# EAGLE design Muleta (EAGLE 9.3.2)
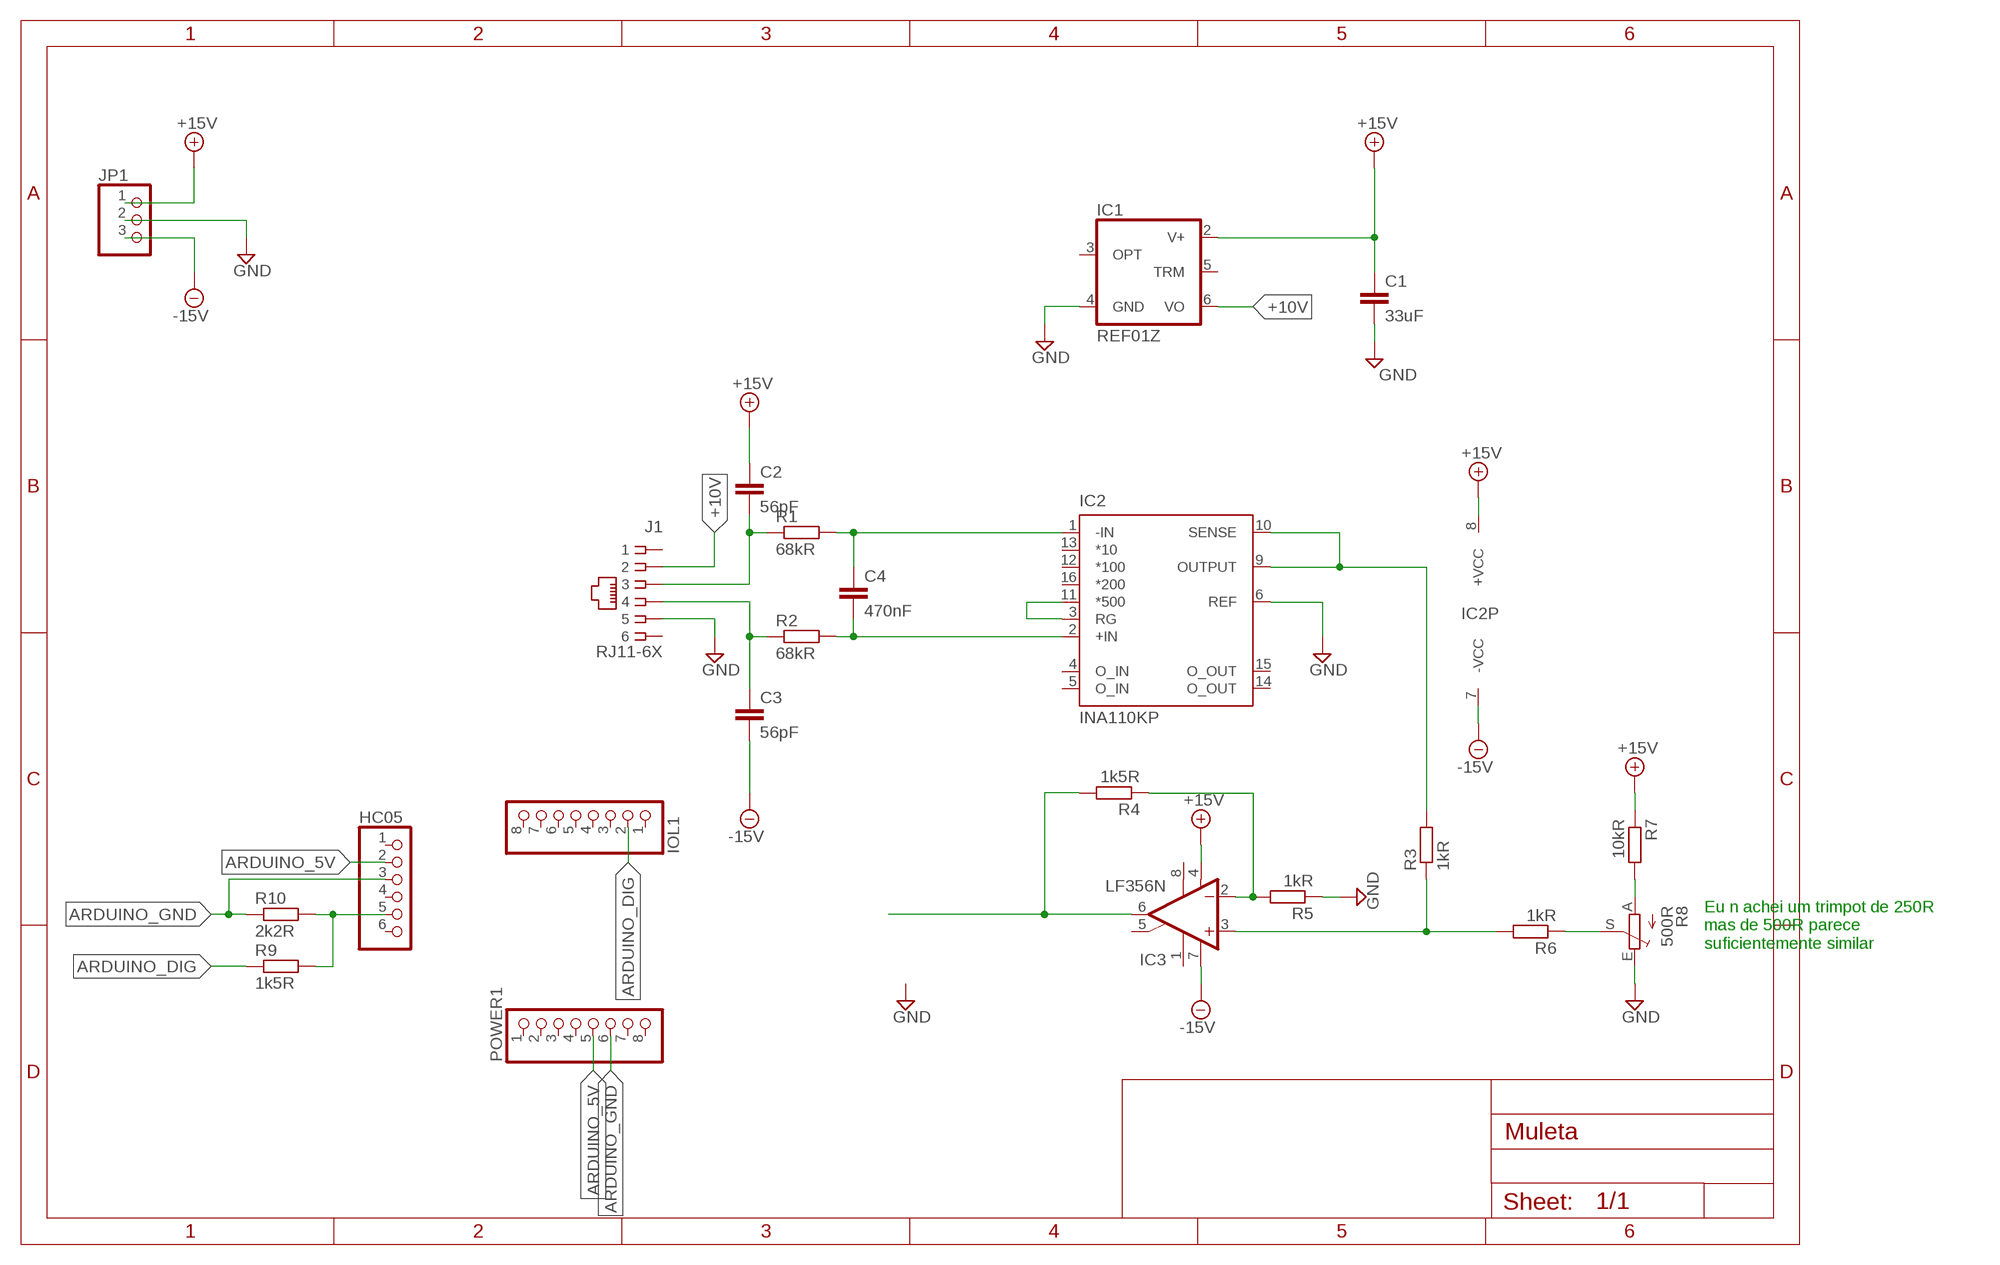
[diagram p0: schematic, sheet 1]

## Parts
C1  33uF  C2,5-3  [C2.5-3]
C2  56pF  C5/2.5  [C5B2.5]
C3  56pF  C5/2.5  [C5B2.5]
C4  470nF  C5/2.5  [C5B2.5]
HC05  PINHD-1X6/90  [1X06/90]
IC1  REF01Z  [DIL08]
IC2  INA110KP  [DIL16]
IC3  LF356N  [DIL08]
IOL1  PINHD-1X8  [1X08]
J1  RJ11-6X  [RJ11-NO_SHIELD]
JP1  PINHD-1X3  [1X03]
POWER1  PINHD-1X8  [1X08]
R1  68kR  R-EU_0207/7  [0207/7]
R2  68kR  R-EU_0207/7  [0207/7]
R3  1kR  R-EU_0207/7  [0207/7]
R4  1k5R  R-EU_0207/7  [0207/7]
R5  1kR  R-EU_0207/7  [0207/7]
R6  1kR  R-EU_0207/7  [0207/7]
R7  10kR  R-EU_0207/7  [0207/7]
R8  500R  TRIM_EU-B64Y  [B64Y]
R9  1k5R  R-EU_0207/7  [0207/7]
R10  2k2R  R-EU_0207/7  [0207/7]

## Nets
+10V: IC1.6(VO) J1.2
+15V: C1.1 C2.1 IC1.2(V+) IC2.8(+VCC) IC3.4(V-) JP1.1 R7.1
-15V: C3.2 IC2.7(-VCC) IC3.7(V+) JP1.3
ARDUINO_5V: HC05.2 POWER1.5
ARDUINO_DIG: IOL1.2 R9.1
ARDUINO_GND: HC05.3 POWER1.6 R10.1
GND: C1.2 IC1.4(GND) IC2.6(REF) J1.5 JP1.2 R5.1 R8.E
N$1: R6.1 R8.S
N$2: R7.2 R8.A
N$4: C3.1 J1.4 R2.1
N$5: C2.2 J1.3 R1.1
N$6: C4.2 IC2.2(+IN) R2.2
N$7: C4.1 IC2.1(-IN) R1.2
N$8: IC2.3(RG) IC2.11(*500)
N$9: IC2.9(OUTPUT) IC2.10(SENSE) R3.2
N$11: IC3.6(OUT) R4.2
N$13: IC3.2(-IN) R4.1 R5.2
N$14: IC3.3(+IN) R3.1 R6.2
N$15: HC05.5 R9.2 R10.2
Unconnected: HC05.1 HC05.4 HC05.6 IC1.3(OPT) IC1.5(TRM) IC2.4(O_IN) IC2.5(O_IN) IC2.12(*100) IC2.13(*10) IC2.14(O_OUT) IC2.15(O_OUT) IC2.16(*200) IC3.1(ON1) IC3.5(ON2) IC3.8(OPT) IOL1.1 IOL1.3 IOL1.4 IOL1.5 IOL1.6 IOL1.7 IOL1.8 J1.1 J1.6 POWER1.1 POWER1.2 POWER1.3 POWER1.4 POWER1.7 POWER1.8

## Notes on the sheet
- Eu n achei um trimpot de 250R
  mas de 500R parece 
  suficientemente similar

## Library data of the parts
C1-C4 = capacitor-wima:C: CAPACITOR naming: grid - package width
HC05 = pinhead:PINHD-1X6: PIN HEADER
IC1 = linear:REF01: VOLTAGE REFERENCE
IC2 = burr-brown:INA110*: Instrumentation Amplifier Fast-Settling FET-Input; MF: TEXAS INSTRUMENTS; MPN: INA110KP; OC_FARNELL: 1097535; OC_NEWARK: 74K3807
IC3 = linear:LF356: OP AMP
IOL1 POWER1 = pinhead:PINHD-1X8: PIN HEADER
J1 = con-tycoelectronics:RJ11: CORCOM Modular RJ Jacks No Shield Source: www.tycoelectronics.com .. ENG_DS_1654001_1099_RJ_L_0507.pdf; MPN: RJ11-6X; OC_FARNELL: unknown; OC_NEWARK: 16R6089
JP1 = pinhead:PINHD-1X3: PIN HEADER
R1-R7 R9 R10 = resistor:R-EU_: RESISTOR, European symbol
R8 = pot:TRIM_EU-: POTENTIOMETER

## Net classes
0 Signal: width 0.406 mm, drill 0.5 mm, clearance 0.305 mm

## Board
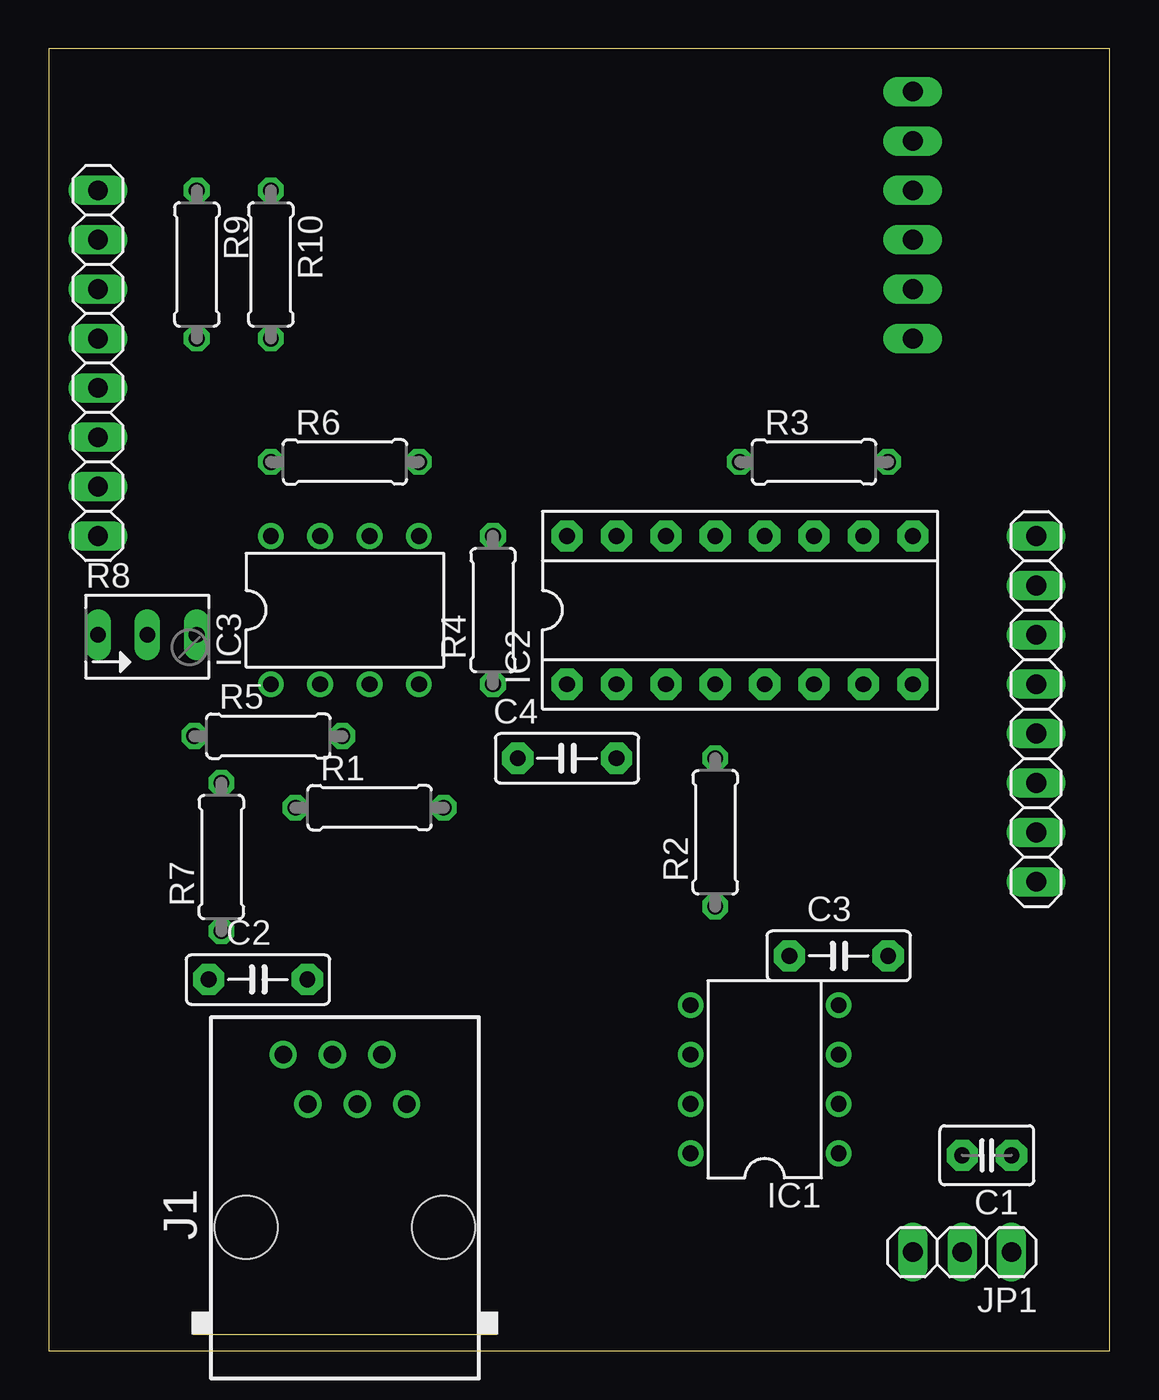
[diagram p1: board, top side]
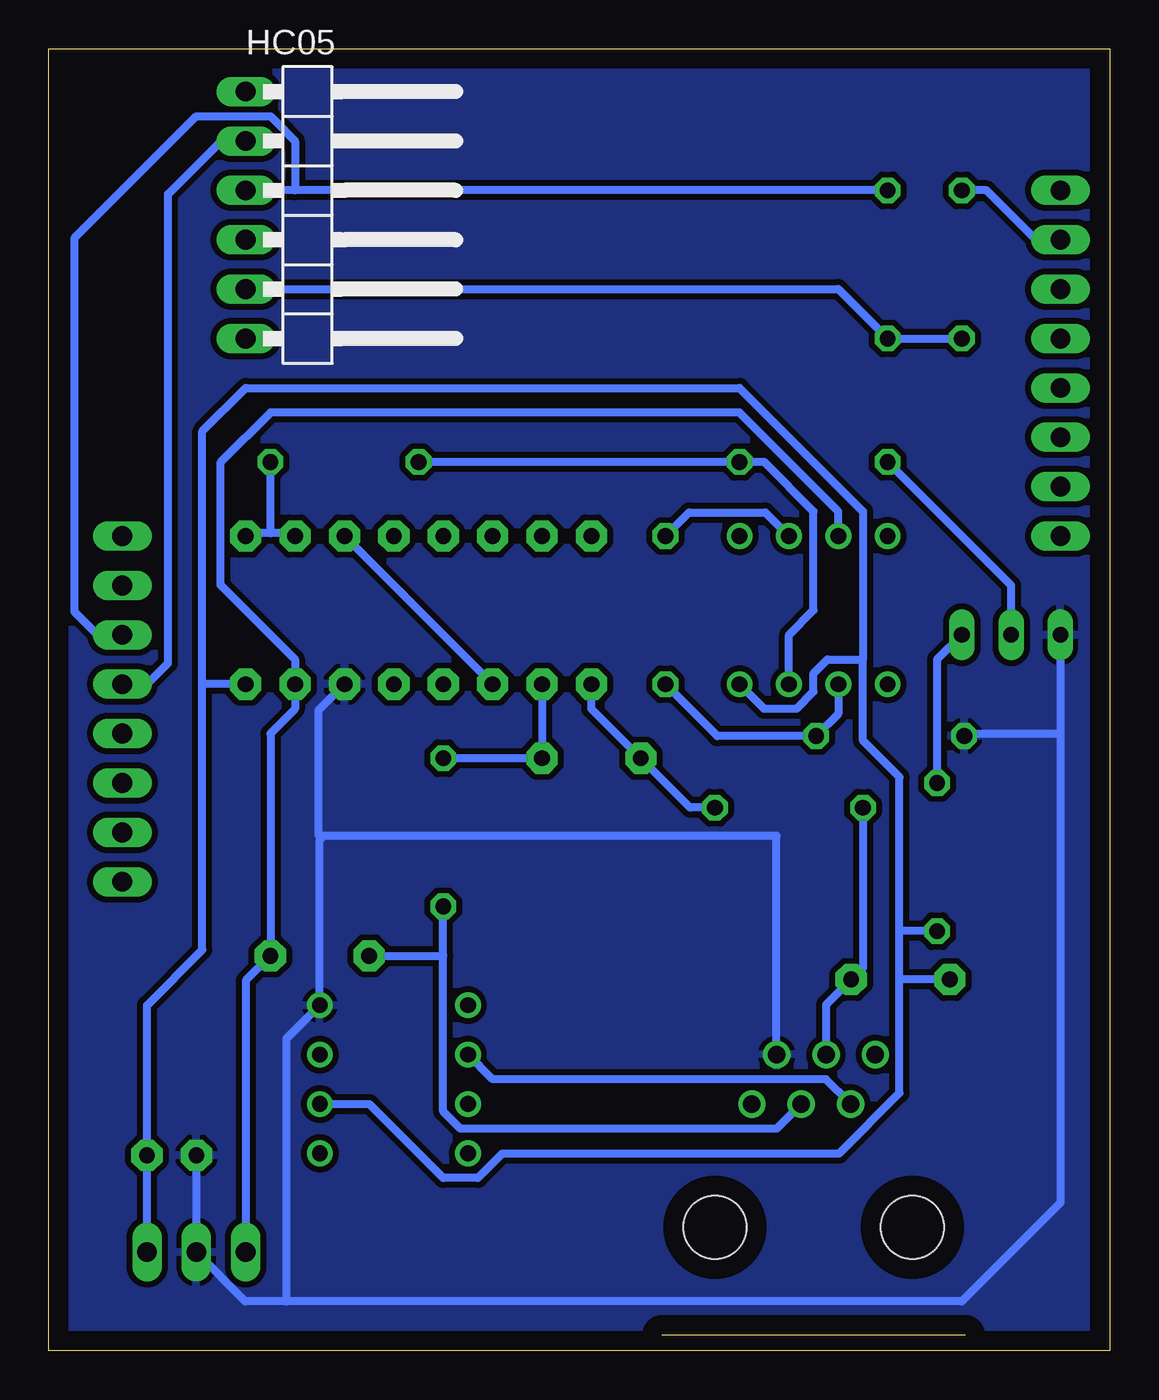
[diagram p2: board, bottom side, seen from below]

Size 54.59 x 66.98 mm. Coordinates in mm from the lower left corner, seen from the top.
Outline: 0,0 54.59,0 54.59,66.98 0,66.98 0,0
Copper layers (1*16): Top 0.035mm / dielectric 1.5mm / Bottom 0.035mm
Design rules "default": minimum track width 6mil, minimum drill 0.35mm, track to track 6mil, track to pad 6mil, pad to pad 6mil, via to via 6mil, smd to smd 6mil, copper to edge 40mil, drill to drill 6mil, minimum pad ring 10mil, minimum via ring 8mil, stop-mask expansion 4mil, vias tented up to drill 0mil, thermal gap 10mil

### Footprints (pad centres in the part's own frame; a part is rotated, then mirrored left to right if it is on the bottom)
C2.5-3 = drill 0.813 pad 1.6 octagon: 1 -1.27,0; 2 1.27,0
C5B2.5 = drill 0.813 pad 1.6 octagon: 1 -2.54,0; 2 2.54,0
1X06/90 = drill 1.016 long: 1 -6.35,-3.81; 2 -3.81,-3.81; 3 -1.27,-3.81; 4 1.27,-3.81; 5 3.81,-3.81; 6 6.35,-3.81
DIL08 = drill 0.813 pad 1.27: 1 -3.81,-3.81; 2 -1.27,-3.81; 3 1.27,-3.81; 4 3.81,-3.81; 5 3.81,3.81; 6 1.27,3.81; 7 -1.27,3.81; 8 -3.81,3.81
DIL16 = drill 0.813 pad 1.6 octagon: 1 -8.89,-3.81; 2 -6.35,-3.81; 3 -3.81,-3.81; 4 -1.27,-3.81; 5 1.27,-3.81; 6 3.81,-3.81; 7 6.35,-3.81; 8 8.89,-3.81; 9 8.89,3.81; 10 6.35,3.81; 11 3.81,3.81; 12 1.27,3.81; 13 -1.27,3.81; 14 -3.81,3.81; 15 -6.35,3.81; 16 -8.89,3.81
1X08 = drill 1.016 long: 1 -8.89,0; 2 -6.35,0; 3 -3.81,0; 4 -1.27,0; 5 1.27,0; 6 3.81,0; 7 6.35,0; 8 8.89,0
RJ11-NO_SHIELD = drill 0.9 pad 1.4: 1 -3.175,8.89; 2 -1.905,6.35; 3 -0.635,8.89; 4 0.635,6.35; 5 1.905,8.89; 6 3.175,6.35 | hole 3.251: -5.08,0; 5.08,0
1X03 = drill 1.016 long: 1 -2.54,0; 2 0,0; 3 2.54,0
0207/7 = drill 0.813 octagon: 1 -3.81,0; 2 3.81,0
B64Y = drill 0.813 long: A 2.54,0; E -2.54,0; S 0,0

### Placement (x,y rotation side)
C1  48.26,10.06 180 top
C2  10.77,19.1 0 top
C3  40.64,20.32 0 top
C4  26.67,30.48 0 top
HC05  40.64,58.42 270 bottom
IC1  36.83,13.97 90 top
IC2  35.56,38.1 0 top
IC3  15.24,38.1 0 top
IOL1  2.54,50.8 270 top
J1  15.24,6.35 0 top
JP1  46.99,5.08 180 top
POWER1  50.8,33.02 90 top
R1  16.51,27.94 0 top
R2  34.29,26.67 90 top
R3  39.37,45.72 0 top
R4  22.86,38.1 90 top
R5  11.3,31.62 0 top
R6  15.24,45.72 0 top
R7  8.89,25.4 90 top
R8  5.08,36.83 0 top
R9  7.62,55.88 270 top
R10  11.43,55.88 270 top

### Tracks (layer width: path | path; a pad name or v marks a point on that pad's centre or on a via)
+10V
  Bottom 0.406: J1.2 14.61,13.97 31.75,13.97 IC1.6
+15V
  Bottom 0.406: 10.82,19.1 10.82,13.26 13.92,10.16 31.24,10.16 32.51,8.89 34.29,8.89 38.1,12.7 IC1.2 | IC3.4 17.78,33.02 16.13,33.02 15.24,33.91 15.24,34.85 14.53,35.56 12.7,35.56 | R7.1 10.82,21.59 | JP1.1 C1.1 49.53,17.78 46.69,20.62 46.69,34.29 | 12.7,35.56 12.7,31.39 10.82,29.52 10.82,21.59 | 12.7,35.56 12.7,43.18 19.05,49.53 44.45,49.53 46.69,47.3 46.69,34.29 | C2.1 10.82,19.1 | 10.82,19.1 10.82,21.59 | IC2.8 46.69,34.29
-15V
  Bottom 0.406: JP1.3 44.45,16.51 44.45,18.04 44.45,19.05 C3.2 43.18,31.75 41.91,33.02 IC2.7 41.91,35.56 45.76,39.41 45.76,45.68 43.18,48.26 19.05,48.26 13.97,43.18 IC3.7
ARDUINO_5V
  Bottom 0.406: POWER1.5 49.53,34.29 48.45,35.37 48.45,59.5 45.72,62.23 HC05.2
ARDUINO_DIG
  Bottom 0.406: IOL1.2 3.81,57.15 6.35,59.69 R9.1
ARDUINO_GND
  Bottom 0.406: POWER1.6 52.07,36.83 53.26,38.02 53.26,57.23 46.99,63.5 43.16,63.5 42.42,62.76 42.42,62.74 41.91,62.23 41.91,59.69 | R10.1 41.91,59.69 | 41.91,59.69 HC05.3
GND
  Bottom 0.406: IC2.6 40.69,32.97 40.69,26.49 40.44,26.49 | J1.5 17.14,26.49 40.44,26.49 | R8.E 2.54,31.75 | 2.54,31.75 2.54,7.62 7.62,2.54 42.37,2.54 | 42.37,2.54 44.47,2.54 45.72,3.79 45.72,3.81 JP1.2 C1.2 | R5.1 7.37,31.75 2.54,31.75 | 42.37,2.54 42.37,16.05 IC1.4 40.64,26.29 40.44,26.49
  pour Bottom: -6.35,68.58 54.91,68.58 54.91,-6.35 -6.35,-6.35
N$1
  Bottom 0.406: R8.S 5.08,39.37 R6.1
N$2
  Bottom 0.406: R8.A 8.89,35.56 R7.2
N$4
  Bottom 0.406: 34.29,20.32 34.29,12.32 33.4,11.43 17.14,11.43 J1.4 | 34.29,20.32 R2.1 | C3.1 34.29,20.32
N$5
  Bottom 0.406: R1.1 12.7,19.71 C2.2 14.61,17.8 J1.3
N$6
  Bottom 0.406: IC2.2 29.21,31.75 C4.2 R2.2
N$7
  Bottom 0.406: R1.2 21.59,27.94 C4.1 26.67,33.02 IC2.1
N$8
  Bottom 0.406: IC2.11 IC2.3
N$9
  Bottom 0.406: 43.18,42.06 R3.2 | 43.18,42.06 41.91,42.06 IC2.10 | 43.18,42.06 44.4,42.06 IC2.9
N$11
  Bottom 0.406: R4.2 21.64,43.13 17.73,43.13 IC3.6
N$13
  Bottom 0.406: 22.71,34.24 R4.1 20.19,31.62 R5.2 13.97,32.77 IC3.2
N$14
  Bottom 0.406: IC3.3 16.51,36.83 15.24,38.1 15.24,43.18 17.78,45.72 R6.2 R3.1
N$15
  Bottom 0.406: R9.2 R10.2 13.97,54.61 HC05.5

### Text on the board
214bmp: D:/SmartProjects/Snc/a4_bn_logo2.bmp